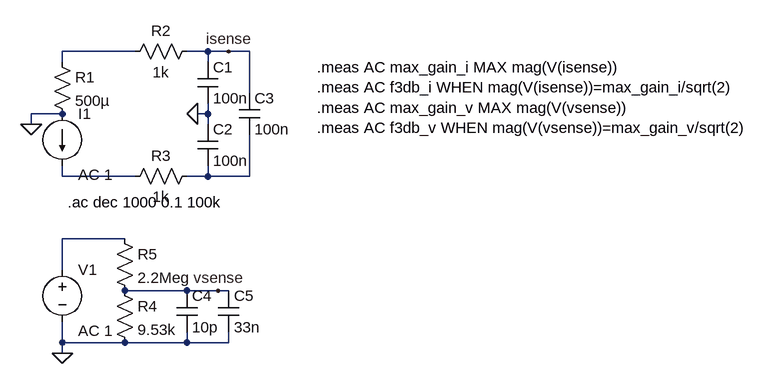
[diagram p0: schematic mcp3913-input-corners.asc]
mcp3913-input-corners.asc, the LTspice schematic file:
Version 4.1
SHEET 1 880 680
WIRE 208 80 96 80
WIRE 320 80 288 80
WIRE 352 80 320 80
WIRE 384 80 352 80
WIRE 96 96 96 80
WIRE 320 96 320 80
WIRE 384 144 384 80
WIRE 96 176 48 176
WIRE 320 176 320 160
WIRE 320 176 304 176
WIRE 48 192 48 176
WIRE 320 192 320 176
WIRE 96 272 96 256
WIRE 208 272 96 272
WIRE 320 272 320 256
WIRE 320 272 288 272
WIRE 384 272 384 208
WIRE 384 272 320 272
WIRE 192 368 96 368
WIRE 96 416 96 368
WIRE 288 448 192 448
WIRE 336 448 288 448
WIRE 352 448 336 448
WIRE 96 528 96 496
WIRE 192 528 96 528
WIRE 288 528 288 512
WIRE 288 528 192 528
WIRE 352 528 352 512
WIRE 352 528 288 528
WIRE 96 544 96 528
FLAG 304 176 0
FLAG 48 192 0
FLAG 96 544 0
FLAG 352 80 isense
FLAG 336 448 vsense
SYMBOL res 80 80 R0
SYMATTR InstName R1
SYMATTR Value 500µ
SYMBOL res 304 64 R90
WINDOW 0 0 56 VBottom 2
WINDOW 3 32 56 VTop 2
SYMATTR InstName R2
SYMATTR Value 1k
SYMBOL res 304 256 R90
WINDOW 0 0 56 VBottom 2
WINDOW 3 32 56 VTop 2
SYMATTR InstName R3
SYMATTR Value 1k
SYMBOL current 96 176 R0
WINDOW 3 24 108 Left 2
WINDOW 123 24 94 Left 2
WINDOW 39 0 0 Left 0
SYMATTR Value ""
SYMATTR Value2 AC 1
SYMATTR InstName I1
SYMBOL cap 304 96 R0
SYMATTR InstName C1
SYMATTR Value 100n
SYMBOL cap 304 192 R0
SYMATTR InstName C2
SYMATTR Value 100n
SYMBOL cap 368 144 R0
SYMATTR InstName C3
SYMATTR Value 100n
SYMBOL voltage 96 400 R0
WINDOW 123 24 110 Left 2
WINDOW 39 0 0 Left 0
SYMATTR Value2 AC 1
SYMATTR InstName V1
SYMATTR Value ""
SYMBOL res 176 432 R0
SYMATTR InstName R4
SYMATTR Value 9.53k
SYMBOL res 176 352 R0
SYMATTR InstName R5
SYMATTR Value 2.2Meg
SYMBOL cap 272 448 R0
SYMATTR InstName C4
SYMATTR Value 10p
SYMBOL cap 336 448 R0
SYMATTR InstName C5
SYMATTR Value 33n
TEXT 104 312 Left 2 !.ac dec 1000 0.1 100k
TEXT 488 104 Left 2 !.meas AC max_gain_i MAX mag(V(isense))\n.meas AC f3db_i WHEN mag(V(isense))=max_gain_i/sqrt(2)\n.meas AC max_gain_v MAX mag(V(vsense))\n.meas AC f3db_v WHEN mag(V(vsense))=max_gain_v/sqrt(2)

The netlist it stands for:
* mcp3913-input-corners.asc
R1 N001 0 500µ
R2 isense N001 1k
R3 N003 N002 1k
I1 0 N002 AC 1
C1 isense 0 100n
C2 0 N003 100n
C3 isense N003 100n
V1 N004 0 AC 1
R4 vsense 0 9.53k
R5 N004 vsense 2.2Meg
C4 vsense 0 10p
C5 vsense 0 33n
.ac dec 1000 0.1 100k
.meas AC max_gain_i MAX mag(V(isense))
.meas AC f3db_i WHEN mag(V(isense))=max_gain_i/sqrt(2)
.meas AC max_gain_v MAX mag(V(vsense))
.meas AC f3db_v WHEN mag(V(vsense))=max_gain_v/sqrt(2)
.backanno
.end